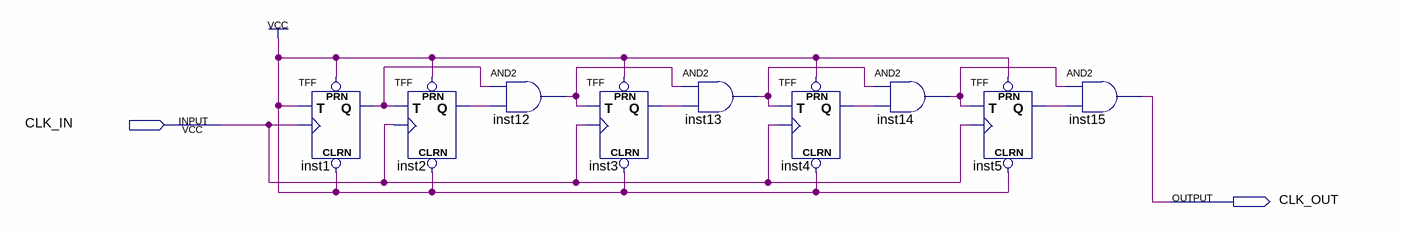
[diagram p0: schematic sheet]
// Quartus schematic clock_divider_1024.bdf as structural Verilog: 9 symbols, 2 pins
module clock_divider_1024 (
  input  CLK_IN,
  output CLK_OUT
);

  wire inst1_q, inst2_q, inst3_q, inst4_q, inst5_q, inst12_out, inst13_out, inst14_out;

  TFF inst1 (.PRN(1'b1), .CLRN(1'b1), .T(1'b1), .CLK(CLK_IN), .Q(inst1_q));
  TFF inst2 (.PRN(1'b1), .CLRN(1'b1), .T(inst1_q), .CLK(CLK_IN), .Q(inst2_q));
  and inst12 (inst12_out, inst1_q, inst2_q);
  TFF inst3 (.PRN(1'b1), .CLRN(1'b1), .T(inst12_out), .CLK(CLK_IN), .Q(inst3_q));
  and inst13 (inst13_out, inst12_out, inst3_q);
  TFF inst4 (.PRN(1'b1), .CLRN(1'b1), .T(inst13_out), .CLK(CLK_IN), .Q(inst4_q));
  and inst14 (inst14_out, inst13_out, inst4_q);
  TFF inst5 (.PRN(1'b1), .CLRN(1'b1), .T(inst14_out), .CLK(CLK_IN), .Q(inst5_q));
  and inst15 (CLK_OUT, inst14_out, inst5_q);
endmodule
